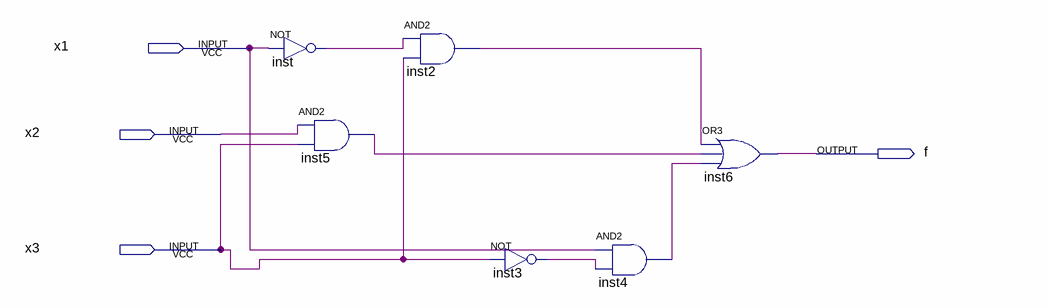
[diagram p0: schematic sheet]
// Quartus schematic ERGASTHRIO1.bdf as structural Verilog: 6 symbols, 4 pins
module ERGASTHRIO1 (
  input  x1,
  input  x2,
  input  x3,
  output f
);

  wire inst2_out, inst3_out, inst4_out, inst5_out, inst_out;

  not inst (inst_out, x1);
  and inst5 (inst5_out, x2, x3);
  and inst2 (inst2_out, inst_out, x3);
  not inst3 (inst3_out, x3);
  and inst4 (inst4_out, x1, inst3_out);
  or inst6 (f, inst2_out, inst5_out, inst4_out);
endmodule
